# EAGLE design Cooling rev3 (EAGLE 7.7.0)
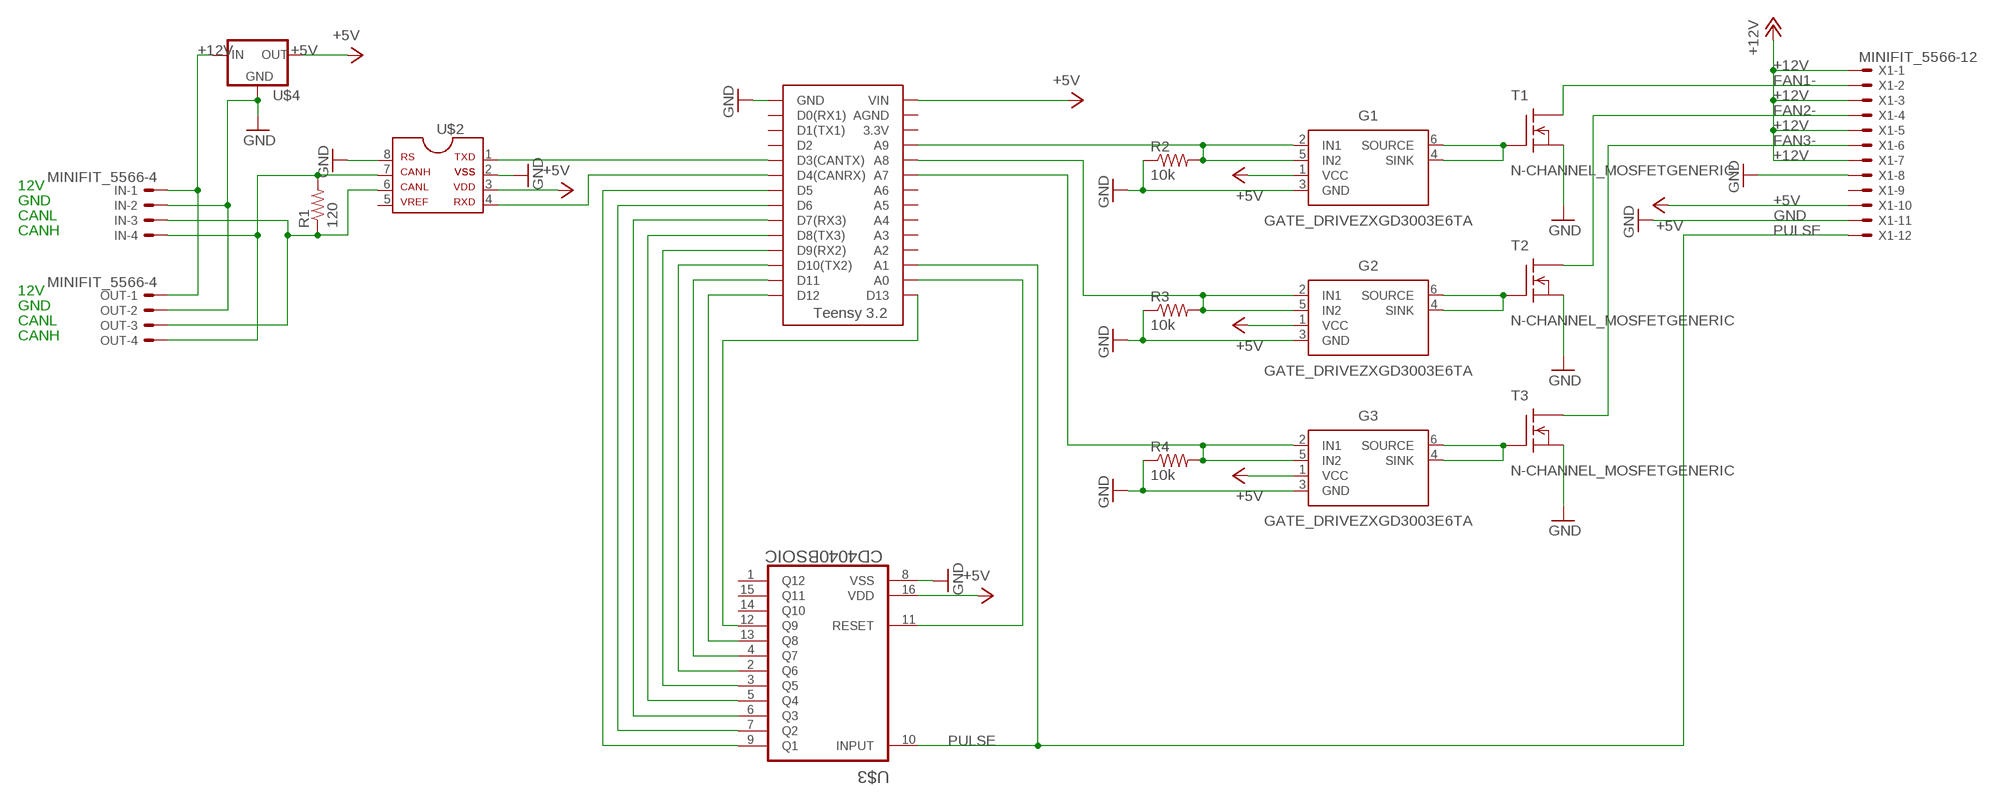
[diagram p0: schematic, sheet 1]

## Parts
G1  GATE_DRIVEZXGD3003E6TA  [SOT23-6]
G2  GATE_DRIVEZXGD3003E6TA  [SOT23-6]
G3  GATE_DRIVEZXGD3003E6TA  [SOT23-6]
IN  MINIFIT_5566-4  [MINIFIT_5566-4]
OUT  MINIFIT_5566-4  [MINIFIT_5566-4]
R1  120  RESISTOR0805-RES  [0805]
R2  10k  RESISTOR0805-RES  [0805]
R3  10k  RESISTOR0805-RES  [0805]
R4  10k  RESISTOR0805-RES  [0805]
T1  N-CHANNEL_MOSFETGENERIC  [TO-220-SINK]
T2  N-CHANNEL_MOSFETGENERIC  [TO-220-SINK]
T3  N-CHANNEL_MOSFETGENERIC  [TO-220-SINK]
U$1  TEENSY_3.2_SIMPLE  [TEENSY_3.2_SIMPLE]
U$2  MCP2551  [SOIC-08]
U$3  CD4040BSOIC  [SOIC-16]
U$4  5V_REGULATOR_LM340-NLM340MPX-5.0/NOPB  [SOT223]
X1  MINIFIT_5566-12  [MINIFIT_5566-12]

## Nets
+5V: G1.1(VCC) G2.1(VCC) G3.1(VCC) U$1.VIN U$2.3 U$3.16(VDD) U$4.3(OUT) X1.10
+12V: IN.1 OUT.1 U$4.1(IN) X1.1 X1.3 X1.5 X1.7
FAN1-: T1.2(D) X1.2
FAN2-: T2.2(D) X1.4
FAN3-: T3.2(D) X1.6
GND: G1.3(GND) G2.3(GND) G3.3(GND) IN.2 OUT.2 R2.1 R3.1 R4.1 T1.3(S) T2.3(S) T3.3(S) U$1.GND U$2.2 U$2.8 U$3.8(VSS) U$4.2(GND) U$4.4(GND) X1.8 X1.11
N$1: G1.4(SINK) G1.6(SOURCE) T1.1(G)
N$2: U$1.D3(CANTX) U$2.1
N$3: U$1.D4(CANRX) U$2.4
N$4: G2.4(SINK) G2.6(SOURCE) T2.1(G)
N$6: G3.4(SINK) G3.6(SOURCE) T3.1(G)
N$8: IN.3 OUT.3 R1.1 U$2.6
N$11: IN.4 OUT.4 R1.2 U$2.7
N$12: U$1.D5 U$3.9(Q1)
N$13: U$1.D6 U$3.7(Q2)
N$14: U$1.D7(RX3) U$3.6(Q3)
N$15: U$1.D8(TX3) U$3.5(Q4)
N$16: U$1.D9(RX2) U$3.3(Q5)
N$17: U$1.D10(TX2) U$3.2(Q6)
N$18: G1.2(IN1) G1.5(IN2) R2.2 U$1.A9
N$19: G2.2(IN1) G2.5(IN2) R3.2 U$1.A8
N$20: G3.2(IN1) G3.5(IN2) R4.2 U$1.A7
N$21: U$1.D11 U$3.4(Q7)
N$22: U$1.D12 U$3.13(Q8)
N$23: U$1.A0 U$3.11(RESET)
N$24: U$1.D13 U$3.12(Q9)
PULSE: U$1.A1 U$3.10(INPUT) X1.12
Unconnected: U$1.3.3V U$1.A2 U$1.A3 U$1.A4 U$1.A5 U$1.A6 U$1.AGND U$1.D0(RX1) U$1.D1(TX1) U$1.D2 U$2.5 U$3.1(Q12) U$3.14(Q10) U$3.15(Q11) X1.9

## Notes on the sheet
- 12V
- GND
- CANL
- CANH
- 12V
- GND
- CANL
- CANH

## Library data of the parts
G1-G3 = HyTechDevices:GATE_DRIVE: Gate drive for MOSFET transistors
IN OUT = HyTechDevices:MINIFIT_5566-4: Mini-Fit Junior connector 4 pole Source: http://www.molex.com; OC_FARNELL: unknown; OC_NEWARK: unknown
R1-R4 = HyTechDevices:RESISTOR: Resistor Basic schematic elements and footprints for 0603, 1206, and PTH resistors.
T1-T3 = HyTechDevices:N-CHANNEL_MOSFET: Generic N-Channel MOSFET; _EXTERNAL_: 1
U$1 = HyTechDevices:TEENSY_3.2_SIMPLE: Simple version of the Teensy 3.2 board that only uses the 2 main rows of pins, not the inner pins or the pins opposite the usb port.
U$2 = HyTechDevices:MCP2551: MCP2551 High-Speed CAN Transceiver Product Webpage <https://www.microchip.com/wwwproducts/en/MCP2551> Datasheet <http://ww1.microchip.com/downloads/en/DeviceDoc/21667f.pdf> This device is outdated It is replaced by MCP2561. Comparison Page <https://www.microchip.com/wwwproducts/ProductCompare/MCP2551/MCP2561> Product Webpage <https://www.microchip.com/wwwproducts/en/MCP2561> Datasheet <http://ww1.microchip.com/downloads/en/DeviceDoc/20005167C.pdf>
U$3 = HyTechDevices:CD4040B: Texas Instruments CD4040B 12-Stage Binary Counter/Divider CMOS Ripple-Carry 12-Stage Binary Counter/Divider
U$4 = HyTechDevices:5V_REGULATOR_LM340-N: Voltage Regulator 5v linear voltage regulator Datasheet <http://www.mouser.com/ProductDetail/Texas-Instruments/LM340MPX-50-NOPB/?qs=X1J7HmVL2ZGZwtTFRQ9ItA%3D%3D> MAX current out: 1.5A MAX voltage in: 35V
X1 = HyTechDevices:MINIFIT_5566-12: Mini-Fit Junior connector 12 pole Source: http://www.molex.com; OC_FARNELL: unknown; OC_NEWARK: unknown

## Board
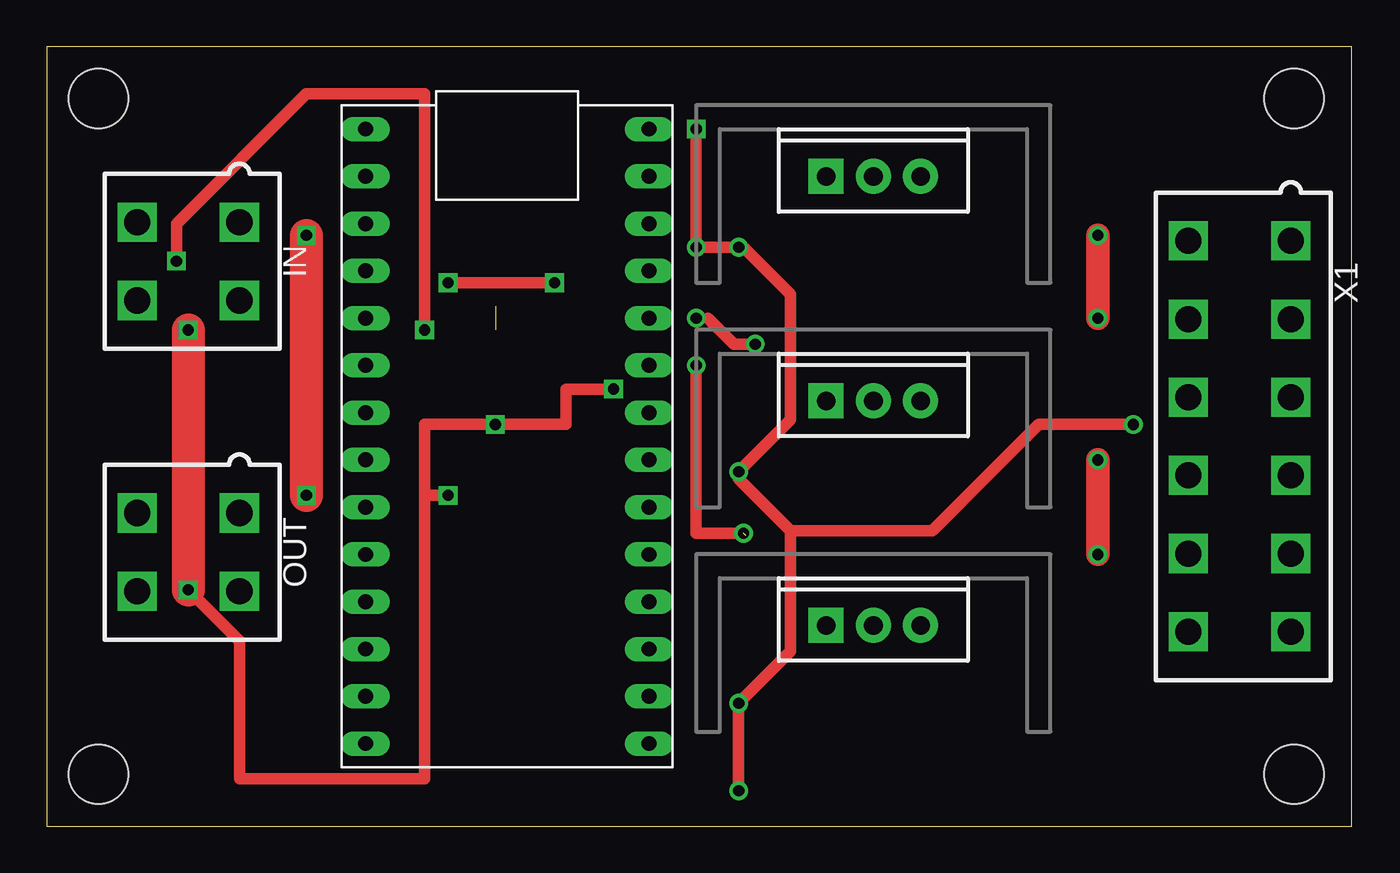
[diagram p1: board, top side]
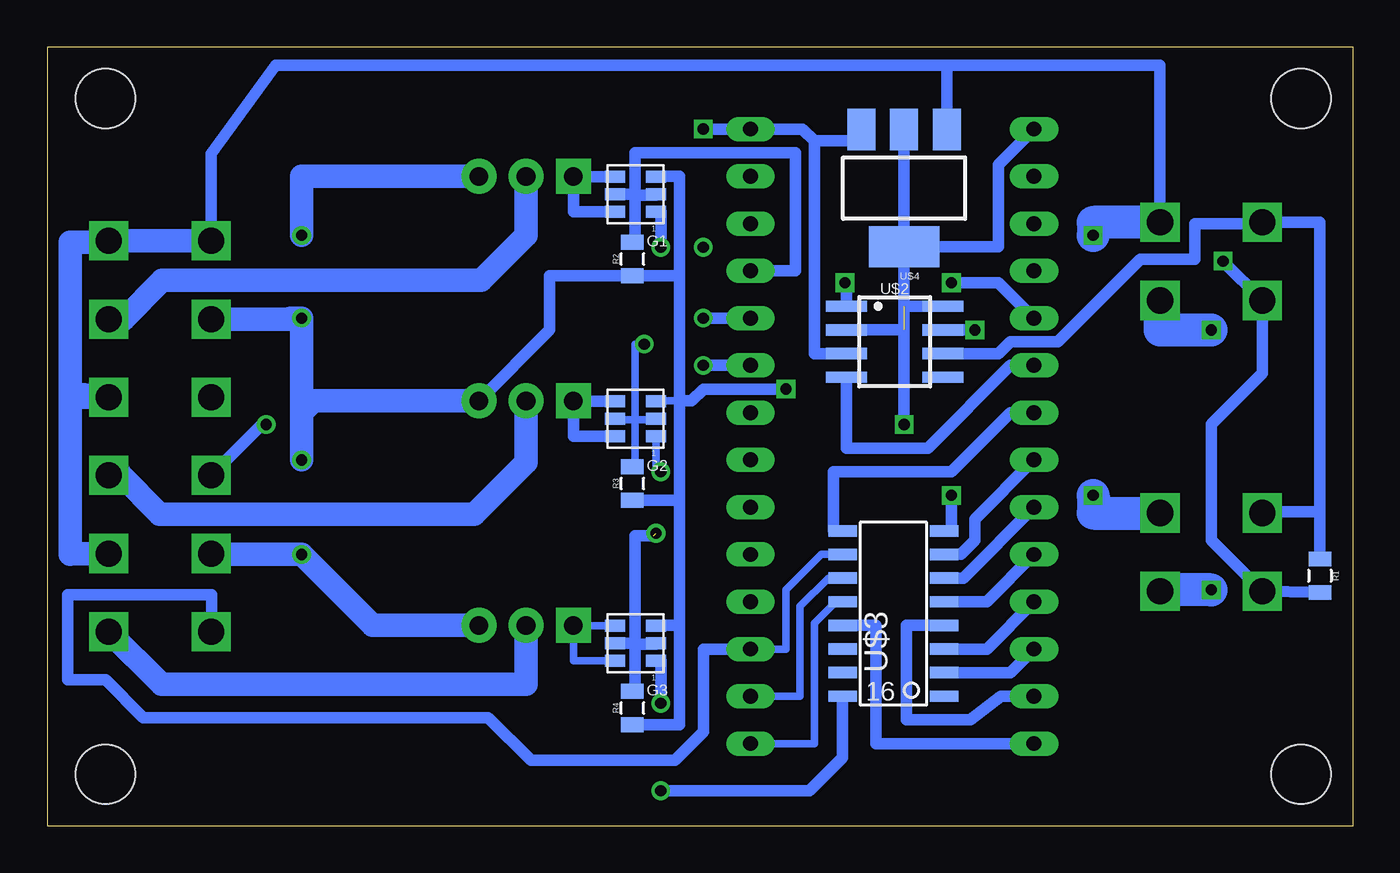
[diagram p2: board, bottom side, seen from below]

Size 70.16 x 41.9 mm. Coordinates in mm from the lower left corner, seen from the top.
Outline: 0,0 70.16,0 70.16,41.9 0,41.9 0,0
Copper layers (1*16): Top 0.035mm / dielectric 1.5mm / Bottom 0.035mm
Design rules "default *": minimum track width 10mil, minimum drill 24mil, track to track 16mil, track to pad 16mil, pad to pad 16mil, via to via 16mil, smd to smd 16mil, copper to edge 40mil, drill to drill 8mil, minimum pad ring 10mil, minimum via ring 8mil, stop-mask expansion 4mil, vias tented up to drill 0mil, thermal gap 10mil
Holes 3.2 mm at 67.06,39.12 2.79,39.12 67.06,2.79 2.79,2.79

### Footprints (pad centres in the part's own frame; a part is rotated, then mirrored left to right if it is on the bottom)
SOT23-6 = smd 0.66 x 1.067: 1 0,0; 2 0.94,0; 3 1.88,0; 4 1.88,2.21; 5 0.94,2.21; 6 0,2.21
MINIFIT_5566-4 = drill 1.4 square: 1 2.1,-2.75; 2 -2.1,-2.75; 3 2.1,2.75; 4 -2.1,2.75
0805 = smd 0.8 x 1.2: 1 -0.9,0; 2 0.9,0
TO-220-SINK = drill 1 pad 1.88 square: 1 -2.54,0 | drill 1 pad 1.88: 2 0,0; 3 2.54,0
TEENSY_3.2_SIMPLE = drill 0.8 long: 3.3V 16.51,29.21; A0 16.51,3.81; A1 16.51,6.35; A2 16.51,8.89; A3 16.51,11.43; A4 16.51,13.97; A5 16.51,16.51; A6 16.51,19.05; A7 16.51,21.59; A8 16.51,24.13; A9 16.51,26.67; AGND 16.51,31.75; D0(RX1) 1.27,31.75; D1(TX1) 1.27,29.21; D2 1.27,26.67; D3(CANTX) 1.27,24.13; D4(CANRX) 1.27,21.59; D5 1.27,19.05; D6 1.27,16.51; D7(RX3) 1.27,13.97; D8(TX3) 1.27,11.43; D9(RX2) 1.27,8.89; D10(TX2) 1.27,6.35; D11 1.27,3.81; D12 1.27,1.27; D13 16.51,1.27; GND 1.27,34.29; VIN 16.51,34.29
SOIC-08 = smd 0.6 x 2.2: 1 -1.905,-2.6; 2 -0.635,-2.6; 3 0.635,-2.6; 4 1.905,-2.6; 5 1.905,2.6; 6 0.635,2.6; 7 -0.635,2.6; 8 -1.905,2.6
SOIC-16 = smd 0.61 x 1.524: 1 -4.445,-2.794; 2 -3.175,-2.794; 3 -1.905,-2.794; 4 -0.635,-2.794; 5 0.635,-2.794; 6 1.905,-2.794; 7 3.175,-2.794; 8 4.445,-2.794; 9 4.445,2.667; 10 3.175,2.667; 11 1.905,2.667; 12 0.635,2.667; 13 -0.635,2.667; 14 -1.905,2.667; 15 -3.175,2.667; 16 -4.445,2.667
SOT223 = smd 1.5 x 2.235: 1 -2.3,-3.15; 2 0,-3.15; 3 2.3,-3.15 | smd 3.8 x 2.2: 4 0,3.15
MINIFIT_5566-12 = drill 1.4 square: 1 10.5,-2.75; 2 6.3,-2.75; 3 2.1,-2.75; 4 -2.1,-2.75; 5 -6.3,-2.75; 6 -10.5,-2.75; 7 10.5,2.75; 8 6.3,2.75; 9 2.1,2.75; 10 -2.1,2.75; 11 -6.3,2.75; 12 -10.5,2.75

### Placement (x,y rotation side)
G1  37.47,33.02 90 bottom
G2  37.47,20.95 90 bottom
G3  37.47,8.89 90 bottom
IN  7.62,30.35 90 top
OUT  7.62,14.73 90 top
R1  1.78,13.46 270 bottom
R2  38.73,30.48 90 bottom
R3  38.73,18.41 90 bottom
R4  38.73,6.35 90 bottom
T1  44.45,34.92 0 top
T2  44.45,22.86 0 top
T3  44.45,10.79 0 top
U$1  15.88,3.17 0 top
U$2  24.64,26.04 270 bottom
U$3  24.77,11.43 90 bottom
U$4  24.13,34.29 180 bottom
X1  64.14,20.95 90 top

### Tracks (layer width: path | path; a pad name or v marks a point on that pad's centre or on a via)
+5V  (via drill 0.6)
  Top 0.406: v37.21,19.05 37.21,18.67 | v37.21,31.11 37.47,31.11
  Top 0.61: v37.21,1.91 v37.21,6.6 40.01,9.4 40.01,15.88 | v37.21,31.11 v34.92,31.11 v34.92,37.47 | 37.21,18.67 40.01,15.88 | 37.47,31.11 40.01,28.57 40.01,21.84 v37.21,19.05 | 40.01,15.88 47.62,15.88 53.34,21.59 v58.42,21.59
  Bottom 0.305: v58.42,21.59 58.65,21.59
  Bottom 0.406: G1.1 37.21,33.02 | v37.21,19.05 37.47,19.05 G2.1 | G3.1 37.21,8.89
  Bottom 0.61: 37.21,33.02 v37.21,31.11 | 37.21,8.89 v37.21,6.6 | 28.96,36.83 29.59,37.47 U$1.VIN v34.92,37.47 | 28.96,36.83 28.96,25.4 U$2.3 | U$3.16 27.43,3.68 29.21,1.91 v37.21,1.91 | 58.65,21.59 X1.10 | U$4.3 27.04,36.83 28.96,36.83
+12V  (via drill 0.6)
  Top 1.778: v13.97,31.75 v13.97,17.78
  Bottom 0.61: X1.7 61.38,36.15 57.91,40.89 21.83,40.89 | 21.83,40.89 10.37,40.89 IN.1 | U$4.1 21.83,40.89
  Bottom 1.27: X1.5 68.78,14.65 68.96,14.61 68.96,23.24 | 68.96,23.24 66.94,23.11 X1.3 68.78,23.05 68.96,23.24 | 68.96,23.24 68.96,31.37 66.97,31.37 X1.1 X1.7
  Bottom 1.778: IN.1 13.97,32.45 v13.97,31.75 | v13.97,17.78 13.97,16.83 OUT.1
FAN1-
  Bottom 1.27: X1.2 66.09,27.25 64.01,29.34 46.86,29.34 44.45,31.75 T1.2
FAN2-
  Bottom 1.27: T2.2 44.45,19.56 47.24,16.76 64.14,16.76 66.23,18.86 X1.4
FAN3-
  Bottom 1.27: 66.8,10.37 X1.6 64.05,7.62 44.45,7.62 T3.2
GND  (via drill 0.6)  (1 unrouted)
  Top 0.61: v7.62,12.7 10.37,9.95 10.37,2.54 20.32,2.54 20.32,17.78 | 20.32,17.78 20.32,21.59 v24.13,21.59 27.94,21.59 27.94,23.5 v30.48,23.5 | v21.59,17.78 20.32,17.78
  Top 1.27: v56.52,19.68 v56.52,14.61 | v56.52,31.75 v56.52,27.3
  Top 1.778: v7.62,26.67 v7.62,12.7
  Bottom 0.406: 37.47,10.79 G3.3 | 36.2,22.86 37.47,22.86 G2.3 | 37.47,34.92 G1.3
  Bottom 0.61: R4.1 36.2,5.45 36.2,10.79 | 36.2,10.79 37.47,10.79 | R3.1 36.2,17.52 | 36.2,17.52 36.2,22.86 | 36.2,29.58 R2.1 43.18,29.59 43.18,26.67 T2.3 | 36.2,29.58 36.2,34.92 37.47,34.92 | 36.2,22.86 35.56,22.86 34.92,23.5 v30.48,23.5 | 36.2,29.58 36.2,22.86 | 36.2,17.52 36.2,10.79 | 17.14,37.39 U$1.GND 19.05,35.56 19.05,31.14 U$4.4 | U$4.4 U$4.2 | v24.13,21.59 24.13,27.94 | 24.13,27.94 U$2.8 | 24.13,26.67 U$2.2 | U$3.8 21.59,15.88 v21.59,17.78 | 24.13,27.94 U$4.4
  Bottom 1.27: X1.8 57.15,27.25 | 57.15,27.25 56.56,27.25 v56.52,27.3 | v56.52,27.3 56.52,22.23 | 56.52,22.23 v56.52,19.68 | X1.11 61.34,14.61 v56.52,14.61 52.7,10.79 T3.3 | T2.3 55.88,22.86 56.52,22.23 | T1.3 56.52,34.92 v56.52,31.75 | v56.52,27.3 57.1,27.3 57.15,27.25
  Bottom 1.778: v7.62,12.7 10.37,12.7 OUT.2 | IN.2 10.37,26.67 v7.62,26.67
N$1
  Bottom 0.406: 41.91,34.9 T1.1
  Bottom 0.61: T1.1 41.91,33.02 G1.6 | G1.4 41.91,34.9
N$2  (via drill 0.6)
  Top 0.61: v21.59,29.21 v27.3,29.21
  Bottom 0.61: U$1.D3(CANTX) 19.05,29.21 v21.59,29.21 | v27.3,29.21 27.24,29.21 U$2.1
N$3
  Bottom 0.61: U$1.D4(CANRX) 18.41,24.77 22.86,20.32 27.24,20.32 U$2.4
N$4
  Bottom 0.406: 41.91,22.84 T2.1
  Bottom 0.61: T2.1 41.91,20.95 G2.6 | G2.4 41.91,22.84
N$6
  Bottom 0.406: G3.4 41.91,10.77 T3.1 41.91,8.89 G3.6
N$8
  Bottom 0.406: 5.08,16.83 OUT.3
  Bottom 0.61: 1.78,16.89 1.78,32.45 IN.3 4.87,32.38 8.51,32.38 8.51,30.48 11.43,30.48 15.88,26.04 18.41,26.04 19.05,25.4 U$2.6 | 1.78,16.89 R1.1 | 1.78,16.89 4.87,16.89 OUT.3
N$11  (via drill 0.6)
  Top 0.61: v20.32,26.67 20.32,39.37 13.97,39.37 6.99,32.38 v6.99,30.37
  Bottom 0.406: OUT.4 5.08,12.63
  Bottom 0.61: 5.08,12.63 R1.2 | U$2.7 v20.32,26.67 | v6.99,30.37 IN.4 4.87,24.34 7.62,21.59 7.62,15.38 OUT.4
N$12
  Bottom 0.305: U$3.9 27.94,15.88
  Bottom 0.61: U$1.D5 18.41,22.23 21.59,19.05 27.94,19.05 27.94,15.88
N$13
  Bottom 0.406: U$3.7 21.08,14.61
  Bottom 0.61: 21.08,14.61 20.32,15.37 20.32,16.51 U$1.D6
N$14
  Bottom 0.61: U$3.6 20.95,13.34 U$1.D7(RX3)
N$15
  Bottom 0.61: U$3.5 19.68,12.06 U$1.D8(TX3)
N$16
  Bottom 0.61: U$3.3 19.68,9.53 U$1.D9(RX2)
N$17
  Bottom 0.61: U$3.2 18.41,8.26 U$1.D10(TX2)
N$18
  Bottom 0.406: 39.67,34.04 G1.5 | 37.47,34.04 G1.2
  Bottom 0.61: 38.61,33.96 38.61,36.2 29.97,36.2 29.97,29.84 U$1.A9 | 38.61,33.96 38.61,33.91 | 38.61,33.91 37.47,33.91 G1.2 | G1.5 38.61,33.96 | 38.61,33.91 38.61,31.38 R2.2
N$19  (via drill 0.6)
  Top 0.406: 35.56,27.3 v34.92,27.3
  Top 0.61: v38.1,25.91 36.96,25.91 35.56,27.3
  Bottom 0.305: G2.2 38.68,21.89 38.61,21.84
  Bottom 0.406: 38.61,21.84 39.67,21.84 G2.5 | 38.61,21.84 37.47,21.84 G2.2 | 38.61,21.84 38.61,25.91 v38.1,25.91 | 38.61,21.84 38.61,19.32 R3.2
  Bottom 0.61: v34.92,27.3 U$1.A8
N$20  (via drill 0.6)  (1 unrouted)
  Top 0.61: v37.47,15.75 34.92,15.75 v34.92,24.77
  Bottom 0.406: 39.67,9.91 G3.5 | 37.47,9.91 G3.2
  Bottom 0.61: v34.92,24.77 U$1.A7 | 37.59,15.62 38.61,15.62 38.61,9.83 | 38.61,9.83 38.61,9.78 | 38.61,9.78 37.47,9.78 G3.2 | G3.5 38.61,9.83 | 38.61,9.78 38.61,7.25 R4.2
N$21
  Bottom 0.61: U$3.4 24,10.79 24,5.71 20.57,5.71 18.92,6.99 U$1.D11
N$22
  Bottom 0.61: U$3.13 25.65,10.79 25.65,4.45 U$1.D12
N$23
  Bottom 0.406: U$1.A0 29.72,6.99 29.72,11.81 28.19,13.34 U$3.11
N$24
  Bottom 0.406: U$1.D13 28.96,4.45 28.96,10.92 27.94,11.94 U$3.12
PULSE
  Bottom 0.305: 61.34,10.41 X1.12
  Bottom 0.406: U$3.10 28.57,14.61 30.48,12.7 30.48,9.53 U$1.A1
  Bottom 0.61: U$1.A1 34.92,9.53 34.92,5.08 36.45,3.56 44.2,3.56 46.48,5.84 65.02,5.84 67.06,7.87 69.09,7.87 69.09,12.45 61.34,12.45 61.34,10.41